# Altium schematic sheet RVP_OVP_HC.SchDoc
size A
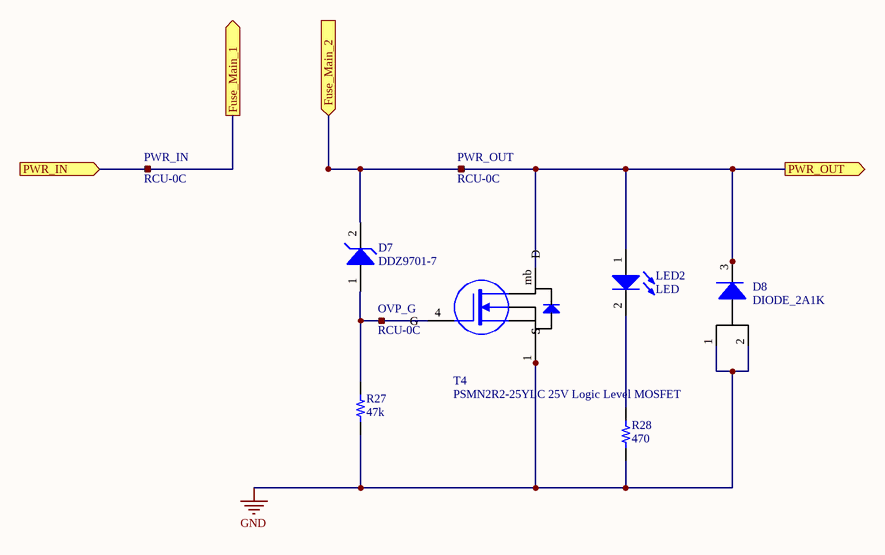
[diagram p0: RVP_OVP_HC.SchDoc]

## Parts
D7  DDZ9701-7  [SOD123F]
D8  DIODE_2A1K  [TO-277]
LED2  LED  [0805_LED]
OVP_G  RCU-0C  [RCU-0C]
PWR_IN  RCU-0C  [RCU-0C]
PWR_OUT  RCU-0C  [RCU-0C]
R27  value 47k  [RES 0805/2012]  (hidden comment: Resistor 47k 0805 1/10W 1%)
R28  value 470  [RES 0805/2012]  (hidden comment: Resistor 470 0805 1/10W 1%)
T4  PSMN2R2-25YLC 25V Logic Level MOSFET  [LFPAK-SO8]

## Ports
Fuse_Main_1 (out), Fuse_Main_2 (in), PWR_IN (in), PWR_OUT (out)

## Nets
GND: D8.1(A1) D8.2(A2) R27.1 R28.1 T4.1(S) T4.2(S) T4.3(S)
Fuse_Main_1: PWR_IN.1 ; port PWR_IN, port Fuse_Main_1
Fuse_Main_2: D7.2(K) D8.3(K) LED2.1(A) PWR_OUT.1 T4.mb(D) ; port PWR_OUT, port Fuse_Main_2
NetD7_1: D7.1(A) OVP_G.1 R27.2 T4.4(G)
NetLED2_2: LED2.2(K) R28.2

## Library data of the parts
D7 = 10: Zener Diode 14V 500mW ±5% Surface Mount SOD-123; Manufacturer_id: 8; idDiode: 10; Drawer_id: 1; Value: 14Vz; MfrPartNo: DDZ9701-7; Name: DDZ9701; Type: Zener; Num_Circuits: 1; Power: 500mW; Package: SOD-123; Link: https://www.digikey.com/product-detail/en/diodes-incorporated/DDZ9701-7/DDZ9701-7DICT-ND/3877402; ComponentLink1Description: Datasheet; ComponentLink1URL: https://www.diodes.com/assets/Datasheets/ds30410.pdf; Supplier1: Digi-Key; Supplier1PartNo: DDZ9701-7DICT-ND
D8 = 11: Manufacturer_id: 1; idDiode: 11; Name: FSV20100V; Value: 20 A; Type: Schottky; Drawer_id: 1; Package: TO-277; MfrPartNo: FSV20100V; Link: https://www.digikey.com/product-detail/en/on-semiconductor/FSV20100V/FSV20100VCT-ND/5306682; ComponentLink1Description: Datasheet; ComponentLink1URL: https://www.fairchildsemi.com/datasheets/FS/FSV20100V.pdf; Supplier1PartNo: FSV20100VCT-ND
LED2 = 2: Manufacturer_id: 1; idLED: 2; Name: CMD17_0805_GREEN; Value: Green; Brightness: 7mcd; Id: 20mA; Vf: 2.1V; Drawer_id: 1; Package: 0805; Link: https://www.digikey.com/product-detail/en/visual-communications-company-vcc/CMD17-21VGD-TR8/L62505CT-ND/254936
OVP_G PWR_IN PWR_OUT = 5: Manufacturer_id: 1; idTable: 5; Name: RCU-0C_Test_Point; Drawer_id: 1; Package: 0603; MfrPartNo: RCU-0C; Link: https://www.digikey.com/product-detail/en/te-connectivity-amp-connectors/RCU-0C/A106145CT-ND/3477802; ComponentLink1Description: Datasheet; ComponentLink1URL: https://www.te.com/commerce/DocumentDelivery/DDEController?Action=srchrtrv&DocNm=1773266&DocType=DS&DocLang=English
R27 = 545: Manufacturer_id: 1; idResistor: 545; Name: Res_47k_0805_1/10W_1%; Created_By: Nick Mah; Supplier 1: Digi-Key; Drawer_id: 1; Tolerance: 1%; Power: 1/10W; Package: 0805; ComponentLink1Description: Datasheet; Created_Date: 2018-10-20
R28 = 497: Manufacturer_id: 1; idResistor: 497; Name: Res_470_0805_1/10W_1%; Created_By: Nick Mah; Supplier 1: Digi-Key; Drawer_id: 1; Tolerance: 1%; Power: 1/10W; Package: 0805; ComponentLink1Description: Datasheet; Created_Date: 2018-10-20
T4 = 3: N-Channel 25V 100A (Tc) 106W (Tc) Surface Mount LFPAK56, Power-SO8; Manufacturer_id: 6; MfrPartNo: PSMN2R2-25YLC,115; idFETs: 3; Drawer_id: 1; Value: N_Channel; Rds_On: 2.5mOhm; Vgs(typ): 10V; Vgs(Max): 20V; Created_By: Nick; Name: PSMN2R2; Vdss: 25V; Num_Circuits: 1; Id: 100A; Package: LFPAK-SO8; Link: https://www.digikey.com/product-detail/en/nexperia-usa-inc/PSMN2R2-25YLC115/1727-5299-1-ND/2674299; ComponentLink1Description: Datasheet; ComponentLink1URL: https://assets.nexperia.com/documents/data-sheet/PSMN2R2-25YLC.pdf; Supplier1: Digi-Key; Supplier1PartNo: 1727-5299-1-ND